# EAGLE schematic ledboard2 (EAGLE 6.5.0)
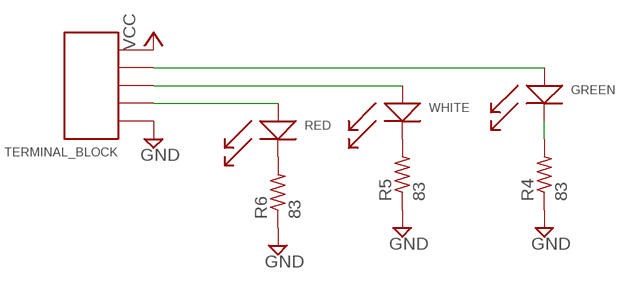
[diagram p0: schematic, sheet 1]

## Parts
GREEN  8MM_LED  [8MM_LED]
R4  83  R-US_0207/12  [0207/12]
R5  83  R-US_0207/12  [0207/12]
R6  83  R-US_0207/12  [0207/12]
RED  8MM_LED  [8MM_LED]
TERMINAL_BLOCK  1X5_3.5MM_TERMINAL_BLOCK  [1X5_3.5MM_TERMINAL_BLOCK]
WHITE  8MM_LED  [8MM_LED]

## Nets
GND: R4.1 R5.1 R6.1 TERMINAL_BLOCK.5
N$1: RED.POS TERMINAL_BLOCK.4
N$2: TERMINAL_BLOCK.3 WHITE.POS
N$3: GREEN.POS TERMINAL_BLOCK.2
N$7: GREEN.NEG R4.2
N$8: R5.2 WHITE.NEG
N$9: R6.2 RED.NEG
VCC: TERMINAL_BLOCK.1

## Library data of the parts
GREEN RED WHITE = e11:8MM_LED
R4-R6 = resistor:R-US_: RESISTOR, American symbol
TERMINAL_BLOCK = e11:1X5_3.5MM_TERMINAL_BLOCK